# Altium schematic sheet 4_DRV_MOTORES_DC.SchDoc
size Tabloid; SheetNumber: 4; SheetTotal: 7; SPICEModelCacheNJINFHSP: <root> / <DocumentId>NJINFHSP</DocumentId> / <CacheFrame Number="0"> / <Model Name="0603_885012206023_330nf" Kind="CKT"> / <Text>******* / .subckt 0603_885012206023_330nF 1 2 / Rser 1 3 0.0113479919005 / Lser 2 4 4.48567636E-10 / C1 3 4 0.00000033 / Rpar 3 4 1500000000 / .ends 0603_885012206023_330nF</Text> / </Model> / <Model Name="0603_885012206121_330nf" Kind="CKT"> / <Text>******* / .subckt 0603_885012206121_330nF 1 2 / Rser 1 3 0.0116331902783 / Lser 2 4 2.98906197E-10 / C1 3 4 0.00000033 / Rpar 3 4 1500000000 / .ends 0603_885012206121_330nF</Text> / </Model> / <Model Name="860080572001_33uf" Kind="CKT"> / <Text>******* / .subckt 860080572001_33uF 1 2 / Rser 1 3 0.18 / Lser 2 4 0.0000000028 / C1 3 4 0.000033 / Rpar 3 4 3030303.03030303 / .ends 860080572001_33uF</Text> / </Model> / <Model Name="0603_885012206008_1nf" Kind="CKT"> / <Text>******* / .subckt 0603_885012206008_1nF 1 2 / Rser 1 3 0.24958 / Lser 2 4 0.00000000040399 / C1 3 4 0.000000001 / Rpar 3 4 10000000000 / .ends 0603_885012206008_1nF</Text> / </Model> / <Model Name="0603_885012206014_10nf" Kind="CKT"> / <Text>******* / .subckt 0603_885012206014_10nF 1 2 / Rser 1 3 0.04641 / Lser 2 4 0.00000000025735 / C1 3 4 0.00000001 / Rpar 3 4 10000000000 / .ends 0603_885012206014_10nF</Text> / </Model> / </CacheFrame> / </root>
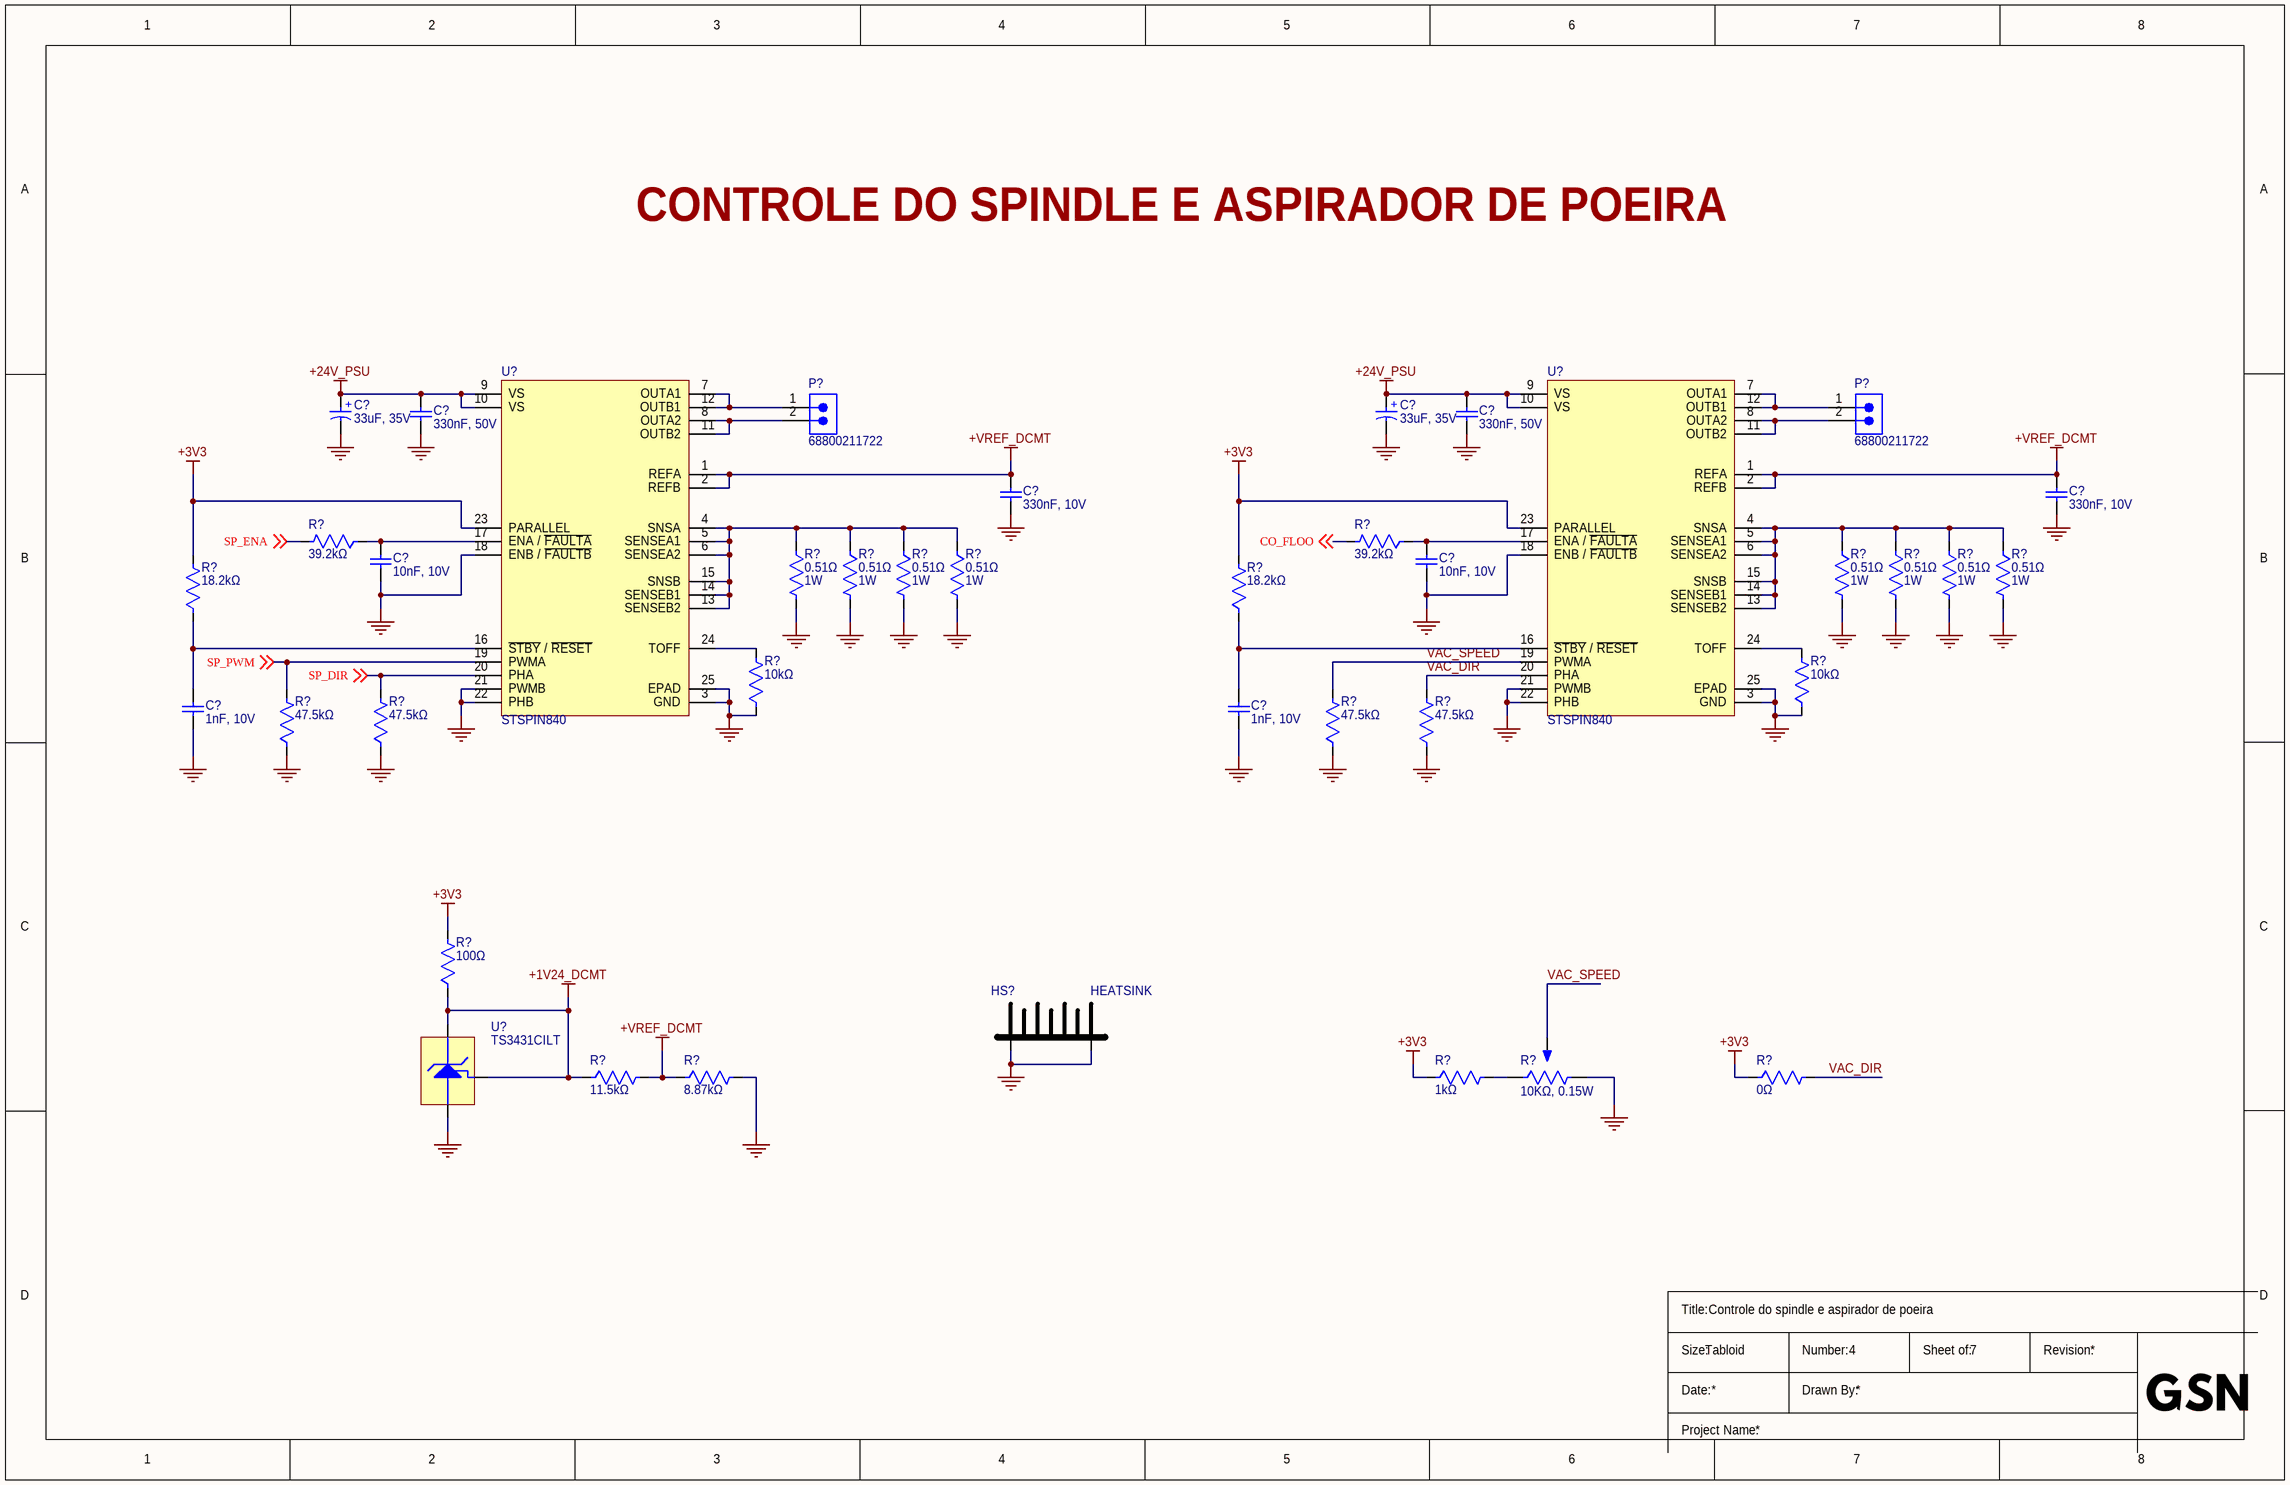
[diagram p0: 4_DRV_MOTORES_DC.SchDoc]

## Parts
(Parts that share a designator on the sheet are numbered #1, #2 ... from top to bottom, then left to right.)
C?#1  33uF, 35V  [WCAP-ATLI_D5H11]
C?#2  33uF, 35V  [WCAP-ATLI_D5H11]
C?#3  330nF, 50V  [WCAP-CSGP_0603_L1.6W0.8H0.8_Reflow]
C?#4  330nF, 50V  [WCAP-CSGP_0603_L1.6W0.8H0.8_Reflow]
C?#5  330nF, 10V  [WCAP-CSGP_0603_L1.6W0.8H0.8_Reflow]
C?#6  330nF, 10V  [WCAP-CSGP_0603_L1.6W0.8H0.8_Reflow]
C?#7  10nF, 10V  [WCAP-CSGP_0603_L1.6W0.8H0.8_Reflow]
C?#8  10nF, 10V  [WCAP-CSGP_0603_L1.6W0.8H0.8_Reflow]
C?#9  1nF, 10V  [WCAP-CSGP_0603_L1.6W0.8H0.8_Reflow]
C?#10  1nF, 10V  [WCAP-CSGP_0603_L1.6W0.8H0.8_Reflow]
HS?  HEATSINK  [HEATSINK_100MM_60MM_10MM_LAYING_DOWN]
P?#1  68800211722  [68800211722]
P?#2  68800211722  [68800211722]
R?#1  39.2kΩ  [0603-REFLOW]
R?#2  0.51Ω  Power Rating: 1W  [2010-REFLOW]
R?#3  0.51Ω  Power Rating: 1W  [2010-REFLOW]
R?#4  0.51Ω  Power Rating: 1W  [2010-REFLOW]
R?#5  0.51Ω  Power Rating: 1W  [2010-REFLOW]
R?#6  39.2kΩ  [0603-REFLOW]
R?#7  0.51Ω  Power Rating: 1W  [2010-REFLOW]
R?#8  0.51Ω  Power Rating: 1W  [2010-REFLOW]
R?#9  0.51Ω  Power Rating: 1W  [2010-REFLOW]
R?#10  0.51Ω  Power Rating: 1W  [2010-REFLOW]
R?#11  18.2kΩ  [0603-REFLOW]
R?#12  18.2kΩ  [0603-REFLOW]
R?#13  10kΩ  [0603-REFLOW]
R?#14  10kΩ  [0603-REFLOW]
R?#15  47.5kΩ  [0603-REFLOW]
R?#16  47.5kΩ  [0603-REFLOW]
R?#17  47.5kΩ  [0603-REFLOW]
R?#18  47.5kΩ  [0603-REFLOW]
R?#19  100Ω  [0603-REFLOW]
R?#20  11.5kΩ  [0603-REFLOW]
R?#21  8.87kΩ  [0603-REFLOW]
R?#22  1kΩ  [0603-REFLOW]
R?#23  10KΩ, 0.15W  [TRIM-3P80MM_3P60MM]
R?#24  0Ω  [0603-REFLOW]
U?#1  STSPIN840  [24-TQFPN]
U?#2  STSPIN840  [24-TQFPN]
U?#3  TS3431CILT  [SOT-23-3]

## Nets
+1V24_DCMT: R?#19.1 R?#20.1 U?#3.1(REF) U?#3.2(CATHODE)
+3V3: R?#11.2 R?#12.2 R?#19.2 R?#22.1 R?#24.1 U?#1.23(PARALLEL) U?#2.23(PARALLEL)
+24V_PSU: C?#1.1(P) C?#2.1(P) C?#3.2 C?#4.2 U?#1.9(VS) U?#1.10(VS) U?#2.9(VS) U?#2.10(VS)
+VREF_DCMT: C?#5.2 C?#6.2 R?#20.2 R?#21.1 U?#1.1(REFA) U?#1.2(REFB) U?#2.1(REFA) U?#2.2(REFB)
GND: C?#1.2(N) C?#2.2(N) C?#3.1 C?#4.1 C?#5.1 C?#6.1 C?#7.1 C?#8.1 C?#9.1 C?#10.1 HS?.H1 HS?.H2 R?#2.2 R?#3.2 R?#4.2 R?#5.2 R?#7.2 R?#8.2 R?#9.2 R?#10.2 R?#13.1 R?#14.1 R?#15.1 R?#16.1 R?#17.1 R?#18.1 R?#21.2 R?#23.3(CW) U?#1.3(GND) U?#1.18(ENB_/_~{FAULTB}) U?#1.21(PWMB) U?#1.22(PHB) U?#1.25(EPAD) U?#2.3(GND) U?#2.18(ENB_/_~{FAULTB}) U?#2.21(PWMB) U?#2.22(PHB) U?#2.25(EPAD) U?#3.3(ANODE)
CO_FLOO: R?#6.2 ; off-sheet CO_FLOO
SP_DIR: R?#16.2 U?#1.20(PHA) ; off-sheet SP_DIR
SP_ENA: R?#1.2 ; off-sheet SP_ENA
SP_PWM: R?#15.2 U?#1.19(PWMA) ; off-sheet SP_PWM
VAC_DIR: R?#18.2 R?#24.2 U?#2.20(PHA)
VAC_SPEED: R?#17.2 R?#23.2(WIPER) U?#2.19(PWMA)
NetC?#7_2: C?#7.2 R?#1.1 U?#1.17(ENA_/_~{FAULTA})
NetC?#8_2: C?#8.2 R?#6.1 U?#2.17(ENA_/_~{FAULTA})
NetC?#9_2: C?#9.2 R?#11.1 U?#1.16(~{STBY}_/_~{RESET})
NetC?#10_2: C?#10.2 R?#12.1 U?#2.16(~{STBY}_/_~{RESET})
NetP?#1_1: P?#1.1 U?#1.7(OUTA1) U?#1.12(OUTB1)
NetP?#1_2: P?#1.2 U?#1.8(OUTA2) U?#1.11(OUTB2)
NetP?#2_1: P?#2.1 U?#2.7(OUTA1) U?#2.12(OUTB1)
NetP?#2_2: P?#2.2 U?#2.8(OUTA2) U?#2.11(OUTB2)
NetR?#2_1: R?#2.1 R?#3.1 R?#4.1 R?#5.1 U?#1.4(SNSA) U?#1.5(SENSEA1) U?#1.6(SENSEA2) U?#1.13(SENSEB2) U?#1.14(SENSEB1) U?#1.15(SNSB)
NetR?#7_1: R?#7.1 R?#8.1 R?#9.1 R?#10.1 U?#2.4(SNSA) U?#2.5(SENSEA1) U?#2.6(SENSEA2) U?#2.13(SENSEB2) U?#2.14(SENSEB1) U?#2.15(SNSB)
NetR?#13_2: R?#13.2 U?#1.24(TOFF)
NetR?#14_2: R?#14.2 U?#2.24(TOFF)
NetR?#22_2: R?#22.2 R?#23.1(CCW)

## Notes on the sheet
- CONTROLE DO SPINDLE E ASPIRADOR DE POEIRA
- Controle do spindle e aspirador de poeira
- Title:
- Size:
- Tabloid
- Number:
- Sheet of:
- Revision:
- Date:
- Project Name:
- Drawn By:
- (in symbol 860080572001) +

## Library data of the parts
C?#1 C?#2 = 860080572001: WCAP-ATLI Aluminum Electrolytic Capacitor, Radial, THT, D5 x H11mm, 33µF, 35V; Manufacturer: Wurth Elektronik; Capacitance Tolerance: +/-20%; Dissipation Factor: 9%; Endurance: 2000h; Leakage Current: 11.55uA; Ripple Current: 230mA; Technical Reference: ATEC110330M035DSPA3B000; Manufacturer Part Number: 860080572001; Category: Aluminum Electrolytic Capacitors; Match Code: WCAP-ATLI; ComponentLink1Description: Website Link; ComponentLink1URL: https://www.we-online.com/redexpert/article/860080572001?ad; ComponentLink2Description: Datasheet Link; ComponentLink2URL: https://www.we-online.com/redexpert/spec/860080572001?ad; Mount: Through Hole; Min Operating Temperature: -55°C; Max Operating Temperature: 105°C; Packaging: Ammo Pack; Height: 11mm; Diameter: 5mm; Capacitance: 33uF; Rated Voltage (DC): 35V
C?#3 C?#4 = 885012206121: WCAP-CSGP Multilayer Ceramic Chip Capacitor, General Purpose, size 0603, 330nF, 50V; Manufacturer: Wurth Elektronik; Case/Size Code: 0603; Capacitance Tolerance: +/-10%; Ceramic Type: X7R; Dissipation Factor: 10%; Insulation Resistance: 1.5GΩ; Technical Reference: X7R0603334K050DFCT10000; Manufacturer Part Number: 885012206121; Category: Multilayer Ceramic Chip Capacitors; Match Code: WCAP-CSGP; ComponentLink1Description: Website Link; ComponentLink1URL: https://www.we-online.com/redexpert/article/885012206121?ad; ComponentLink2Description: Datasheet Link; ComponentLink2URL: https://www.we-online.com/redexpert/spec/885012206121?ad; Mount: Surface Mount; Min Operating Temperature: -55°C; Max Operating Temperature: 125°C; Packaging: Tape and Reel; Length: 1.6mm; Width: 0.8mm; Height: 0.8mm; Capacitance: 330nF; Rated Voltage (DC): 50V
C?#5 C?#6 = 885012206023: WCAP-CSGP Multilayer Ceramic Chip Capacitor, General Purpose, size 0603, 330nF, 10V; Manufacturer: Wurth Elektronik; Case/Size Code: 0603; Capacitance Tolerance: +/-10%; Ceramic Type: X7R; Dissipation Factor: 10%; Insulation Resistance: 1.5GΩ; Technical Reference: X7R0603334K010DFCT10000; Manufacturer Part Number: 885012206023; Category: Multilayer Ceramic Chip Capacitors; Match Code: WCAP-CSGP; ComponentLink1Description: Website Link; ComponentLink1URL: https://www.we-online.com/redexpert/article/885012206023?ad; ComponentLink2Description: Datasheet Link; ComponentLink2URL: https://www.we-online.com/redexpert/spec/885012206023?ad; Mount: Surface Mount; Min Operating Temperature: -55°C; Max Operating Temperature: 125°C; Packaging: Tape and Reel; Length: 1.6mm; Width: 0.8mm; Height: 0.8mm; Capacitance: 330nF; Rated Voltage (DC): 10V
C?#7 C?#8 = 885012206014: WCAP-CSGP Multilayer Ceramic Chip Capacitor, General Purpose, size 0603, 10nF, 10V; Manufacturer: Wurth Elektronik; Case/Size Code: 0603; Capacitance Tolerance: +/-10%; Ceramic Type: X7R; Dissipation Factor: 5%; Insulation Resistance: 10GΩ; Technical Reference: X7R0603103K010DFCT10000; Manufacturer Part Number: 885012206014; Category: Multilayer Ceramic Chip Capacitors; Match Code: WCAP-CSGP; ComponentLink1Description: Website Link; ComponentLink1URL: https://www.we-online.com/redexpert/article/885012206014?ad; ComponentLink2Description: Datasheet Link; ComponentLink2URL: https://www.we-online.com/redexpert/spec/885012206014?ad; Mount: Surface Mount; Min Operating Temperature: -55°C; Max Operating Temperature: 125°C; Packaging: Tape and Reel; Length: 1.6mm; Width: 0.8mm; Height: 0.8mm; Capacitance: 10nF; Rated Voltage (DC): 10V
C?#9 C?#10 = 885012206008: WCAP-CSGP Multilayer Ceramic Chip Capacitor, General Purpose, size 0603, 1nF, 10V; Manufacturer: Wurth Elektronik; Case/Size Code: 0603; Capacitance Tolerance: +/-10%; Ceramic Type: X7R; Dissipation Factor: 5%; Insulation Resistance: 10GΩ; Technical Reference: X7R0603102K010DFCT10000; Manufacturer Part Number: 885012206008; Category: Multilayer Ceramic Chip Capacitors; Match Code: WCAP-CSGP; ComponentLink1Description: Website Link; ComponentLink1URL: https://www.we-online.com/redexpert/article/885012206008?ad; ComponentLink2Description: Datasheet Link; ComponentLink2URL: https://www.we-online.com/redexpert/spec/885012206008?ad; Mount: Surface Mount; Min Operating Temperature: -55°C; Max Operating Temperature: 125°C; Packaging: Tape and Reel; Length: 1.6mm; Width: 0.8mm; Height: 0.8mm; Capacitance: 1nF; Rated Voltage (DC): 10V
HS? = GENERIC-HEATSINK-100X60X10MM: GENERIC HEATSINK 100X60X10MM; Manufacturer: OEM; Manufacturer Part Number: None
P?#1 P?#2 = 68800211722: WR-WTB “J” Type THT Male Horizontal Shrouded Header, pitch 2.5 mm, 2 pins; Manufacturer: Wurth Elektronik; Contact Resistance: 20 mohm; Rated Current: 3 A; Working Voltage: 250 V(AC); Withstanding Voltage: 800 V(AC); Manufacturer Part Number: 68800211722; Category: Wire-to-Board Connector; Match Code: WR-WTB; ComponentLink1Description: Website Link; ComponentLink1URL: https://www.we-online.com/redexpert/article/68800211722?ad; ComponentLink2Description: Datasheet Link; ComponentLink2URL: https://www.we-online.com/redexpert/spec/68800211722?ad; Mount: Through Hole; Operating Temperature Min: -25degC; Operating Temperature Max: 85degC; Packaging: Bag; Length: 7.5 mm; Width: 8.3 mm; Height: 4.2 mm; Gender: Male; Number of Pins: 2; Number of Rows: 1; Orientation: Horizontal; Lead Pitch: 2.5 mm
R?#1 R?#6 = RC0603FR-0739K2L: RES 39.2K OHM 1% 1/10W 0603; Manufacturer: Yageo Group; Max Power Dissipation: 100mW; Temperature Coefficient: ±200ppm/°C; Voltage Rating (AC): 50V; Voltage Rating: 75V; Supplier Part Number: 311-39.2KHRCT-ND; Manufacturer Part Number: RC0603FR-0739K2L; Value: 39.2kΩ; Case Code (Imperial): 0603; Case Code (Metric): 1608; Case/Package: 0603; Category: Chip SMD Resistors; China RoHS: Non-Compliant; Composition: Thick Film; Contact Plating: Tin; Depth: 800µm; Features: Moisture Resistant; Height: 450µm; Lead Free: Lead Free; Length: 1.6mm; Lifecycle Status: Production; Max Operating Temperature: 155°C; Military Standard: Not; Min Operating Temperature: -55°C; Mounting Technology: Surface Mount; Number of Terminals: 2; Number of Terminations: 2; Packaging: Tape & Reel; Power Dissipation: 100mW; Power Rating: 100mW; Radiation Hardening: No; REACH SVHC: Yes; RoHS: Compliant; Supplier: DigiKey; Termination: SMD/SMT; Tolerance: 1%; Component Link Description: https://www.yageogroup.com/content/datasheet/asset/file/PYU-RC_GROUP_51_ROHS_L; Component Link URL: https://www.yageogroup.com/content/datasheet/asset/file/PYU-RC_GROUP_51_ROHS_L; Datasheet: https://www.yageogroup.com/content/datasheet/asset/file/PYU-RC_GROUP_51_ROHS_L; Voltage Rating (DC): 50V; Weight: 2.012816mg; Width: 800µm; Working Voltage: 75V
R?#2-R?#5 R?#7-R?#10 = RCWE2010R510FKEA: RES 0.51 OHM 1% 1W 2010; Manufacturer: Vishay; Value: 510mΩ; Temperature Coefficient: 100ppm/°C; Working Voltage: 714.1mV; Supplier: DigiKey; Supplier Part Number: RCWE.51GCT-ND; Manufacturer Part Number: RCWE2010R510FKEA; RoHS: Compliant; Category: Chip SMD Resistors; Stock: 6435; Pricing: 1=0.65, 10=0.417, 25=0.3544, 50=0.3156, 100=0.2824, 250=0.24596, 500=0.22314, 1000=0.20376 (USD); Case/Package: 2010; Case Code (Imperial): 2010; Case Code (Metric): 5025; China RoHS: Non-Compliant; Composition: Thick Film; Contact Plating: Tin; Features: Automotive AEC-Q200, Moisture Resistant; Height: 600µm; Length: 5.0038mm; Lifecycle Status: Production; Max Operating Temperature: 155°C; Max Power Dissipation: 1W; Min Operating Temperature: -55°C; Mounting Technology: Surface Mount; Pins: 2; Number of Terminals: 2; Number of Terminations: 2; Power Dissipation: 1W; Radiation Hardening: No; REACH SVHC: Yes; Schedule B: 8533210045, 8533210045|8533210045|8533210045|8533210045|8533210045; Termination: SMD/SMT; Tolerance: 1%; Width: 2.5mm; ComponentLink1URL: https://datasheet.octopart.com:443/RCWE2010R510FKEA-Vishay-datasheet-170667730.pdf?src-supplier=IHS; ComponentLink1Description: https://datasheet.octopart.com:443/RCWE2010R510FKEA-Vishay-datasheet-170667730.pdf?src-supplier=IHS; ComponentLink2URL: https://datasheet.octopart.com:443/RCWE2010R510FKEA-Vishay-datasheet-78835242.pdf?src-supplier=Newark; ComponentLink2Description: https://datasheet.octopart.com:443/RCWE2010R510FKEA-Vishay-datasheet-78835242.pdf?src-supplier=Newark; ComponentLink3URL: https://datasheet.octopart.com:443/RCWE2010R510FKEA-Vishay-datasheet-10025643.pdf?src-supplier=element14+APAC; ComponentLink3Description: https://datasheet.octopart.com:443/RCWE2010R510FKEA-Vishay-datasheet-10025643.pdf?src-supplier=element14+APAC; ComponentLink4URL: http://sigma.octopart.com:80/rohs_statement/Vishay-company-15.pdf?src-supplier=Compliance+Statements; ComponentLink4Description: http://sigma.octopart.com:80/rohs_statement/Vishay-company-15.pdf?src-supplier=Compliance+Statements
R?#11 R?#12 = RC0603FR-0718K2L: RES 18.2K OHM 1% 1/10W 0603; Manufacturer: Yageo Group; Max Power Dissipation: 100mW; Temperature Coefficient: ±200ppm/°C; Voltage Rating (AC): 50V; Voltage Rating: 75V; Supplier Part Number: 311-18.2KHRCT-ND; Manufacturer Part Number: RC0603FR-0718K2L; Value: 18.2kΩ; Case Code (Imperial): 0603; Case Code (Metric): 1608; Case/Package: 0603; Category: Chip SMD Resistors; China RoHS: Non-Compliant; Composition: Thick Film; Contact Plating: Tin; Depth: 800µm; Features: Moisture Resistant; Height: 450µm; Lead Free: Lead Free; Length: 1.6mm; Lifecycle Status: Production; Max Operating Temperature: 155°C; Military Standard: Not; Min Operating Temperature: -55°C; Mounting Technology: Surface Mount; Number of Terminals: 2; Number of Terminations: 2; Packaging: Tape & Reel; Power Dissipation: 100mW; Power Rating: 100mW; Radiation Hardening: No; REACH SVHC: Yes; RoHS: Compliant; Supplier: DigiKey; Termination: SMD/SMT; Tolerance: 1%; Component Link Description: https://www.yageogroup.com/content/datasheet/asset/file/PYU-RC_GROUP_51_ROHS_L; Component Link URL: https://www.yageogroup.com/content/datasheet/asset/file/PYU-RC_GROUP_51_ROHS_L; Datasheet: https://www.yageogroup.com/content/datasheet/asset/file/PYU-RC_GROUP_51_ROHS_L; Voltage Rating (DC): 50V; Weight: 2.012816mg; Width: 800µm; Working Voltage: 75V
R?#13 R?#14 = RC0603FR-0710KL: RES 10K OHM 1% 1/10W 0603; Manufacturer: Yageo Group; Max Power Dissipation: 100mW; Temperature Coefficient: ±200ppm/°C; Voltage Rating (AC): 50V; Voltage Rating: 75V; Supplier Part Number: 311-10.0KHRCT-ND; Manufacturer Part Number: RC0603FR-0710KL; Value: 10kΩ; Case Code (Imperial): 0603; Case Code (Metric): 1608; Case/Package: 0603; Category: Chip SMD Resistors; China RoHS: Non-Compliant; Composition: Thick Film; Contact Plating: Tin; Depth: 800µm; Features: Moisture Resistant; Height: 450µm; Lead Free: Lead Free; Length: 1.6mm; Lifecycle Status: Production; Max Operating Temperature: 155°C; Military Standard: Not; Min Operating Temperature: -55°C; Mounting Technology: Surface Mount; Number of Terminals: 2; Number of Terminations: 2; Packaging: Tape & Reel; Power Dissipation: 100mW; Power Rating: 100mW; Radiation Hardening: No; REACH SVHC: Yes; RoHS: Compliant; Supplier: DigiKey; Termination: SMD/SMT; Tolerance: 1%; Component Link Description: https://www.yageogroup.com/content/datasheet/asset/file/PYU-RC_GROUP_51_ROHS_L; Component Link URL: https://www.yageogroup.com/content/datasheet/asset/file/PYU-RC_GROUP_51_ROHS_L; Datasheet: https://www.yageogroup.com/content/datasheet/asset/file/PYU-RC_GROUP_51_ROHS_L; Voltage Rating (DC): 50V; Weight: 2.012816mg; Width: 800µm; Working Voltage: 75V
R?#15-R?#18 = RC0603FR-0747K5L: RES 47.5K OHM 1% 1/10W 0603; Manufacturer: Yageo Group; Max Power Dissipation: 100mW; Temperature Coefficient: ±200ppm/°C; Voltage Rating (AC): 50V; Voltage Rating: 75V; Supplier Part Number: 311-47.5KHRCT-ND; Manufacturer Part Number: RC0603FR-0747K5L; Value: 47.5kΩ; Case Code (Imperial): 0603; Case Code (Metric): 1608; Case/Package: 0603; Category: Chip SMD Resistors; China RoHS: Non-Compliant; Composition: Thick Film; Contact Plating: Tin; Depth: 800µm; Features: Moisture Resistant; Height: 450µm; Lead Free: Lead Free; Length: 1.6mm; Lifecycle Status: Production; Max Operating Temperature: 155°C; Military Standard: Not; Min Operating Temperature: -55°C; Mounting Technology: Surface Mount; Number of Terminals: 2; Number of Terminations: 2; Packaging: Tape & Reel; Power Dissipation: 100mW; Power Rating: 100mW; Radiation Hardening: No; REACH SVHC: Yes; RoHS: Compliant; Supplier: DigiKey; Termination: SMD/SMT; Tolerance: 1%; Component Link Description: https://www.yageogroup.com/content/datasheet/asset/file/PYU-RC_GROUP_51_ROHS_L; Component Link URL: https://www.yageogroup.com/content/datasheet/asset/file/PYU-RC_GROUP_51_ROHS_L; Datasheet: https://www.yageogroup.com/content/datasheet/asset/file/PYU-RC_GROUP_51_ROHS_L; Voltage Rating (DC): 50V; Weight: 2.012816mg; Width: 800µm; Working Voltage: 75V
R?#19 = RC0603FR-07100RL: RES 100 OHM 1% 1/10W 0603; Manufacturer: Yageo Group; Max Power Dissipation: 100mW; Temperature Coefficient: ±200ppm/°C; Voltage Rating (AC): 50V; Voltage Rating: 75V; Supplier Part Number: 311-100HRCT-ND; Manufacturer Part Number: RC0603FR-07100RL; Value: 100Ω; Case Code (Imperial): 0603; Case Code (Metric): 1608; Case/Package: 0603; Category: Chip SMD Resistors; China RoHS: Non-Compliant; Composition: Thick Film; Contact Plating: Tin; Depth: 800µm; Features: Moisture Resistant; Height: 450µm; Lead Free: Lead Free; Length: 1.6mm; Lifecycle Status: Production; Max Operating Temperature: 155°C; Military Standard: Not; Min Operating Temperature: -55°C; Mounting Technology: Surface Mount; Number of Terminals: 2; Number of Terminations: 2; Packaging: Tape & Reel; Power Dissipation: 100mW; Power Rating: 100mW; Radiation Hardening: No; REACH SVHC: Yes; RoHS: Compliant; Supplier: DigiKey; Termination: SMD/SMT; Tolerance: 1%; Component Link Description: https://www.yageogroup.com/content/datasheet/asset/file/PYU-RC_GROUP_51_ROHS_L; Component Link URL: https://www.yageogroup.com/content/datasheet/asset/file/PYU-RC_GROUP_51_ROHS_L; Datasheet: https://www.yageogroup.com/content/datasheet/asset/file/PYU-RC_GROUP_51_ROHS_L; Voltage Rating (DC): 50V; Weight: 2.012816mg; Width: 800µm; Working Voltage: 75V
R?#20 = RC0603FR-0711K5L: RES 11.5K OHM 1% 1/10W 0603; Manufacturer: Yageo Group; Max Power Dissipation: 100mW; Temperature Coefficient: ±200ppm/°C; Voltage Rating (AC): 50V; Voltage Rating: 75V; Supplier Part Number: 311-11.5KHRCT-ND; Manufacturer Part Number: RC0603FR-0711K5L; Value: 11.5kΩ; Case Code (Imperial): 0603; Case Code (Metric): 1608; Case/Package: 0603; Category: Chip SMD Resistors; China RoHS: Non-Compliant; Composition: Thick Film; Contact Plating: Tin; Depth: 800µm; Features: Moisture Resistant; Height: 450µm; Lead Free: Lead Free; Length: 1.6mm; Lifecycle Status: Production; Max Operating Temperature: 155°C; Military Standard: Not; Min Operating Temperature: -55°C; Mounting Technology: Surface Mount; Number of Terminals: 2; Number of Terminations: 2; Packaging: Tape & Reel; Power Dissipation: 100mW; Power Rating: 100mW; Radiation Hardening: No; REACH SVHC: Yes; RoHS: Compliant; Supplier: DigiKey; Termination: SMD/SMT; Tolerance: 1%; Component Link Description: https://www.yageogroup.com/content/datasheet/asset/file/PYU-RC_GROUP_51_ROHS_L; Component Link URL: https://www.yageogroup.com/content/datasheet/asset/file/PYU-RC_GROUP_51_ROHS_L; Datasheet: https://www.yageogroup.com/content/datasheet/asset/file/PYU-RC_GROUP_51_ROHS_L; Voltage Rating (DC): 50V; Weight: 2.012816mg; Width: 800µm; Working Voltage: 75V
R?#21 = RC0603FR-078K87L: RES 8.87K OHM 1% 1/10W 0603; Manufacturer: Yageo Group; Max Power Dissipation: 100mW; Temperature Coefficient: ±200ppm/°C; Voltage Rating (AC): 50V; Voltage Rating: 75V; Supplier Part Number: 311-8.87KHRCT-ND; Manufacturer Part Number: RC0603FR-078K87L; Value: 8.87kΩ; Case Code (Imperial): 0603; Case Code (Metric): 1608; Case/Package: 0603; Category: Chip SMD Resistors; China RoHS: Non-Compliant; Composition: Thick Film; Contact Plating: Tin; Depth: 800µm; Features: Moisture Resistant; Height: 450µm; Lead Free: Lead Free; Length: 1.6mm; Lifecycle Status: Production; Max Operating Temperature: 155°C; Military Standard: Not; Min Operating Temperature: -55°C; Mounting Technology: Surface Mount; Number of Terminals: 2; Number of Terminations: 2; Packaging: Tape & Reel; Power Dissipation: 100mW; Power Rating: 100mW; Radiation Hardening: No; REACH SVHC: Yes; RoHS: Compliant; Supplier: DigiKey; Termination: SMD/SMT; Tolerance: 1%; Component Link Description: https://www.yageogroup.com/content/datasheet/asset/file/PYU-RC_GROUP_51_ROHS_L; Component Link URL: https://www.yageogroup.com/content/datasheet/asset/file/PYU-RC_GROUP_51_ROHS_L; Datasheet: https://www.yageogroup.com/content/datasheet/asset/file/PYU-RC_GROUP_51_ROHS_L; Voltage Rating (DC): 50V; Weight: 2.012816mg; Width: 800µm; Working Voltage: 75V
R?#22 = RC0603FR-071KL: RES 1K OHM 1% 1/10W 0603; Manufacturer: Yageo Group; Max Power Dissipation: 100mW; Temperature Coefficient: ±200ppm/°C; Voltage Rating (AC): 50V; Voltage Rating: 75V; Supplier Part Number: 311-1.00KHRCT-ND; Manufacturer Part Number: RC0603FR-071KL; Value: 1kΩ; Case Code (Imperial): 0603; Case Code (Metric): 1608; Case/Package: 0603; Category: Chip SMD Resistors; China RoHS: Non-Compliant; Composition: Thick Film; Contact Plating: Tin; Depth: 800µm; Features: Moisture Resistant; Height: 450µm; Lead Free: Lead Free; Length: 1.6mm; Lifecycle Status: Production; Max Operating Temperature: 155°C; Military Standard: Not; Min Operating Temperature: -55°C; Mounting Technology: Surface Mount; Number of Terminals: 2; Number of Terminations: 2; Packaging: Tape & Reel; Power Dissipation: 100mW; Power Rating: 100mW; Radiation Hardening: No; REACH SVHC: Yes; RoHS: Compliant; Supplier: DigiKey; Termination: SMD/SMT; Tolerance: 1%; Component Link Description: https://www.yageogroup.com/content/datasheet/asset/file/PYU-RC_GROUP_51_ROHS_L; Component Link URL: https://www.yageogroup.com/content/datasheet/asset/file/PYU-RC_GROUP_51_ROHS_L; Datasheet: https://www.yageogroup.com/content/datasheet/asset/file/PYU-RC_GROUP_51_ROHS_L; Voltage Rating (DC): 50V; Weight: 2.012816mg; Width: 800µm; Working Voltage: 75V
R?#23 = TC33X-2-103E: TRIMMER 10K OHM 0.15W J LEAD TOP; Manufacturer: Bourns; Max Power Dissipation: 100mW; Number of Turns: 1; Power Dissipation: 150mW; Temperature Coefficient: 250ppm/°C; Tolerance: 25%; Voltage Rating (DC): 50V; Supplier: DigiKey; Supplier Part Number: TC33X-103ECT-ND; Manufacturer Part Number: TC33X-2-103E; RoHS: Compliant; Category: Variable Resistors and Potentiometers; Stock: 18061; Pricing: 1=0.25, 10=0.213, 25=0.1996, 50=0.1896, 100=0.18, 250=0.168, 500=0.15938, 1000=0.15119 (USD); Color: Silver; Composition: Cermet, Potentiometer; Contact Plating: Copper, Silver, Tin; Depth: 3.8mm; Height: 1.2mm; Lead Free: Lead Free; Length: 3mm; Lifecycle Status: Production; Max Operating Temperature: 100°C; Military Standard: Not; Min Operating Temperature: -40°C; Mounting Technology: Surface Mount; Number of Terminals: 3; Packaging: Cut Tape; Power Rating: 100mW; Radiation Hardening: No; REACH SVHC: Yes; Value: 10kΩ; Schedule B: 8533400080, 8533400080|8533400080|8533400080|8533400080|8533400080; Taper: Linear; Termination: Foot Print; Weight: 29.4mg; Width: 3.6mm; Working Voltage: 50V; ComponentLink1URL: https://datasheet.octopart.com:443/TC33X-2-103E-Bourns-datasheet-182142024.pdf?src-supplier=IHS; ComponentLink1Description: https://datasheet.octopart.com:443/TC33X-2-103E-Bourns-datasheet-182142024.pdf?src-supplier=IHS; ComponentLink2URL: https://datasheet.octopart.com:443/TC33X-2-103E-Bourns-datasheet-134530277.pdf?src-supplier=Upverter; ComponentLink2Description: https://datasheet.octopart.com:443/TC33X-2-103E-Bourns-datasheet-134530277.pdf?src-supplier=Upverter; ComponentLink3URL: https://datasheet.octopart.com:443/TC33X-2-103E-Bourns-datasheet-11551316.pdf?src-supplier=element14+APAC; ComponentLink3Description: https://datasheet.octopart.com:443/TC33X-2-103E-Bourns-datasheet-11551316.pdf?src-supplier=element14+APAC; ComponentLink4URL: https://datasheet.octopart.com:443/TC33X-2-103E-Bourns-datasheet-65566108.pdf?src-supplier=element14+APAC; ComponentLink4Description: https://datasheet.octopart.com:443/TC33X-2-103E-Bourns-datasheet-65566108.pdf?src-supplier=element14+APAC; ComponentLink5URL: https://datasheet.octopart.com:443/TC33X-2-103E-Bourns-datasheet-67039831.pdf?src-supplier=Farnell; ComponentLink5Description: https://datasheet.octopart.com:443/TC33X-2-103E-Bourns-datasheet-67039831.pdf?src-supplier=Farnell; ComponentLink6URL: https://datasheet.octopart.com:443/TC33X-2-103E-Bourns-datasheet-164917123.pdf?src-supplier=Farnell; ComponentLink6Description: https://datasheet.octopart.com:443/TC33X-2-103E-Bourns-datasheet-164917123.pdf?src-supplier=Farnell; ComponentLink7URL: https://datasheet.octopart.com:443/TC33X-2-103E-Bourns-datasheet-38800.pdf?src-supplier=Farnell; ComponentLink7Description: https://datasheet.octopart.com:443/TC33X-2-103E-Bourns-datasheet-38800.pdf?src-supplier=Farnell; ComponentLink8URL: https://datasheet.octopart.com:443/TC33X-2-103E-Bourns-datasheet-26822215.pdf?src-supplier=Newark; ComponentLink8Description: https://datasheet.octopart.com:443/TC33X-2-103E-Bourns-datasheet-26822215.pdf?src-supplier=Newark; ComponentLink9URL: https://datasheet.octopart.com:443/TC33X-2-103E-Bourns-datasheet-41964919.pdf?src-supplier=Newark; ComponentLink9Description: https://datasheet.octopart.com:443/TC33X-2-103E-Bourns-datasheet-41964919.pdf?src-supplier=Newark; ComponentLink10URL: https://datasheet.octopart.com:443/TC33X-2-103E-Bourns-datasheet-154730028.pdf?src-supplier=Electro+Sonic; ComponentLink10Description: https://datasheet.octopart.com:443/TC33X-2-103E-Bourns-datasheet-154730028.pdf?src-supplier=Electro+Sonic; ComponentLink11URL: https://datasheet.octopart.com:443/TC33X-2-103E-Bourns-datasheet-47549324.pdf?src-supplier=RS+(Formerly+Allied+Electronics); ComponentLink11Description: https://datasheet.octopart.com:443/TC33X-2-103E-Bourns-datasheet-47549324.pdf?src-supplier=RS+(Formerly+Allied+Electronics); ComponentLink12URL: https://datasheet.octopart.com:443/TC33X-2-103E-Bourns-datasheet-549861.pdf?src-supplier=RS+(Formerly+Allied+Electronics); ComponentLink12Description: https://datasheet.octopart.com:443/TC33X-2-103E-Bourns-datasheet-549861.pdf?src-supplier=RS+(Formerly+Allied+Electronics); ComponentLink13URL: https://datasheet.octopart.com:443/TC33X-2-103E-Bourns-datasheet-5319878.pdf?src-supplier=element14; ComponentLink13Description: https://datasheet.octopart.com:443/TC33X-2-103E-Bourns-datasheet-5319878.pdf?src-supplier=element14; ComponentLink14URL: https://datasheet.octopart.com:443/TC33X-2-103E-Bourns-datasheet-177040515.pdf?src-supplier=Burklin+Elektronik; ComponentLink14Description: https://datasheet.octopart.com:443/TC33X-2-103E-Bourns-datasheet-177040515.pdf?src-supplier=Burklin+Elektronik; ComponentLink15URL: https://datasheet.octopart.com:443/TC33X-2-103E-Bourns-datasheet-39003.pdf?src-supplier=Mouser; ComponentLink15Description: https://datasheet.octopart.com:443/TC33X-2-103E-Bourns-datasheet-39003.pdf?src-supplier=Mouser; ComponentLink16URL: http://sigma.octopart.com:80/conflict_mineral_statement/Bourns-company-36.pdf?src-supplier=Compliance+Statements; ComponentLink16Description: http://sigma.octopart.com:80/conflict_mineral_statement/Bourns-company-36.pdf?src-supplier=Compliance+Statements
R?#24 = RC0603FR-070RL: RES 0 OHM 1% 1/10W 0603; Manufacturer: Yageo Group; Max Power Dissipation: 100mW; Temperature Coefficient: ±200ppm/°C; Voltage Rating (AC): 50V; Voltage Rating: 75V; Supplier Part Number: 311-0.0HRCT-ND; Manufacturer Part Number: RC0603FR-070RL; Value: 0Ω; Case Code (Imperial): 0603; Case Code (Metric): 1608; Case/Package: 0603; Category: Chip SMD Resistors; China RoHS: Non-Compliant; Composition: Thick Film; Contact Plating: Tin; Depth: 800µm; Features: Moisture Resistant; Height: 450µm; Lead Free: Lead Free; Length: 1.6mm; Lifecycle Status: Production; Max Operating Temperature: 155°C; Military Standard: Not; Min Operating Temperature: -55°C; Mounting Technology: Surface Mount; Number of Terminals: 2; Number of Terminations: 2; Packaging: Tape & Reel; Power Dissipation: 100mW; Power Rating: 100mW; Radiation Hardening: No; REACH SVHC: Yes; RoHS: Compliant; Supplier: DigiKey; Termination: SMD/SMT; Tolerance: 1%; Component Link Description: https://www.yageogroup.com/content/datasheet/asset/file/PYU-RC_GROUP_51_ROHS_L; Component Link URL: https://www.yageogroup.com/content/datasheet/asset/file/PYU-RC_GROUP_51_ROHS_L; Datasheet: https://www.yageogroup.com/content/datasheet/asset/file/PYU-RC_GROUP_51_ROHS_L; Voltage Rating (DC): 50V; Weight: 2.012816mg; Width: 800µm; Working Voltage: 75V
U?#1 U?#2 = STSPIN840: IC MOTOR DRIVER 7V-45V 24TQFPN; Manufacturer: STMicroelectronics; Drain to Source Resistance: 500mΩ; Interface: Parallel; Max Output current: 1.5A; Max Supply Voltage: 45V; Min Supply Voltage: 7V; Number of Circuits: 1; Operating Supply Voltage: 36V; Output Voltage: 48V; Supplier: DigiKey; Supplier Part Number: 497-18119-1-ND; Manufacturer Part Number: STSPIN840; RoHS: Compliant; Category: Motor Drivers; Stock: 9342; Pricing: 1=2.95, 10=2.208, 25=2.022, 100=1.8174, 250=1.71984, 500=1.66102, 1000=1.61261 (USD); China RoHS: Compliant; Height - Seated (Max): 1.1mm; Length: 4mm; Lifecycle Status: Production; Max Operating Temperature: 150°C; Min Operating Temperature: -40°C; Number of Terminals: 24; Output Current: 1.5A; REACH SVHC: Yes; Schedule B: 8542390000, 8542390000|8542390000|8542390000|8542390000|8542390000; Terminal Pitch: 500µm; Width: 4mm; ComponentLink1URL: https://datasheet.octopart.com:443/STSPIN840-STMicroelectronics-datasheet-116891059.pdf?src-supplier=ODG+(Origin+Data+Global); ComponentLink1Description: https://datasheet.octopart.com:443/STSPIN840-STMicroelectronics-datasheet-116891059.pdf?src-supplier=ODG+(Origin+Data+Global)
U?#3 = TS3431CILT: IC VREF SHUNT ADJ 0.25% SOT23-3; Manufacturer: STMicroelectronics; Cathode Current: 400µA; Max Supply Voltage: 25V; Max Output current: 100mA; Max Output Voltage: 1.243V; Min Output Voltage: 1.237V; Min Supply Voltage: 1.24V; Number of Channels: 1; Output Voltage: 24V; Reference Type: Adjustable, Shunt; Temperature Coefficient: 100ppm/°C; Supplier: DigiKey; Supplier Part Number: 497-4637-1-ND; Manufacturer Part Number: TS3431CILT; RoHS: Compliant; Category: Voltage References; Stock: 16066; Pricing: 1=0.62, 10=0.44, 25=0.3944, 100=0.3441, 250=0.32016, 500=0.30574, 1000=0.29386 (USD); Case/Package: SOT-23; China RoHS: Compliant; Height: 1.02mm; Height - Seated (Max): 1.12mm; Lead Free: Lead Free; Length: 2.9mm; Lifecycle Status: Production; Max Operating Temperature: 125°C; Min Operating Temperature: -40°C; Mounting Technology: Surface Mount; Nominal Supply Voltage: 1.24V; Nominal Output Voltage: 1.24V; Nominal Supply Current: 400µA; Number of Circuits: 1; Number of Outputs: 1; Pins: 3; Number of Terminals: 3; Output Current: 100mA; Packaging: Tape and Reel; Radiation Hardening: No; REACH SVHC: Yes; Reference Voltage: 1.24V; Schedule B: 8542390000, 8542390000|8542390000|8542390000|8542390000|8542390000; Terminal Pitch: 950µm; Termination: SMD/SMT; Tolerance: 0.25%; Width: 1.3mm; ComponentLink1URL: https://datasheet.octopart.com:443/TS3431CILT-STMicroelectronics-datasheet-12523092.pdf?src-supplier=SHENGYU+ELECTRONICS; ComponentLink1Description: https://datasheet.octopart.com:443/TS3431CILT-STMicroelectronics-datasheet-12523092.pdf?src-supplier=SHENGYU+ELECTRONICS; ComponentLink2URL: https://datasheet.octopart.com:443/TS3431CILT-STMicroelectronics-datasheet-10408717.pdf?src-supplier=Upverter; ComponentLink2Description: https://datasheet.octopart.com:443/TS3431CILT-STMicroelectronics-datasheet-10408717.pdf?src-supplier=Upverter; ComponentLink3URL: https://datasheet.octopart.com:443/TS3431CILT-STMicroelectronics-datasheet-124172.pdf?src-supplier=Farnell; ComponentLink3Description: https://datasheet.octopart.com:443/TS3431CILT-STMicroelectronics-datasheet-124172.pdf?src-supplier=Farnell; ComponentLink4URL: https://datasheet.octopart.com:443/TS3431CILT-STMicroelectronics-datasheet-140368796.pdf?src-supplier=TME; ComponentLink4Description: https://datasheet.octopart.com:443/TS3431CILT-STMicroelectronics-datasheet-140368796.pdf?src-supplier=TME; ComponentLink5URL: https://datasheet.octopart.com:443/TS3431CILT-STMicroelectronics-datasheet-18487.pdf?src-supplier=DigiKey; ComponentLink5Description: https://datasheet.octopart.com:443/TS3431CILT-STMicroelectronics-datasheet-18487.pdf?src-supplier=DigiKey